# Altium project stepper_motor.PrjPcb
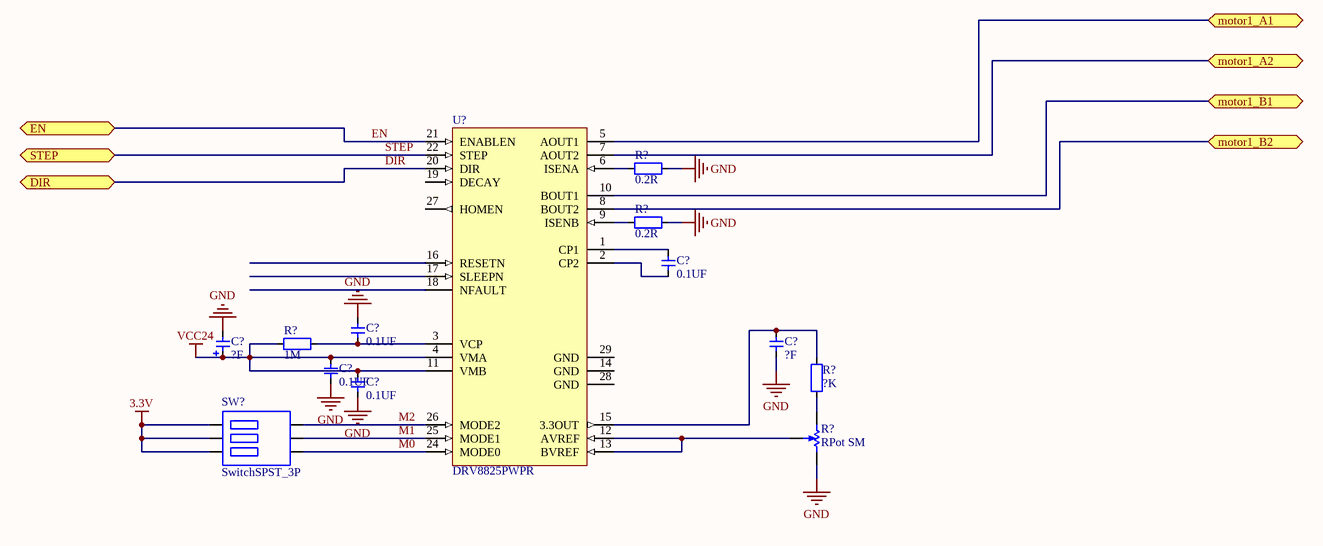
[diagram p0: drv8825.SchDoc]
6 sheets, 109 parts. Net scope: hierarchical (ports join the sheet entries above them; power ports are global).
Board file: stepper_motor.PcbDoc
Sheets:
  drv8825.SchDoc
  stepper_motor.SchDoc
    U_DRV8825_MODE1 = DRV8825_MODE.SchDoc
    U_stm32f1 = stm32f1.SchDoc
    U_power = power.SchDoc
    U_output = output.SchDoc
    U_DRV8825_MODE2 = DRV8825_MODE.SchDoc
    U_DRV8825_MODE3 = DRV8825_MODE.SchDoc
    U_DRV8825_MODE4 = DRV8825_MODE.SchDoc
    U_DRV8825_MODE5 = DRV8825_MODE.SchDoc
    U_DRV8825_MODE6 = DRV8825_MODE.SchDoc
    U_DRV8825_MODE7 = DRV8825_MODE.SchDoc

## Sheet drv8825.SchDoc
size A4

### Parts
(Parts that share a designator on the sheet are numbered #1, #2 ... from top to bottom, then left to right.)
C?#1  value 0.1UF  [CAP_0603]  (hidden comment: Cap_0603)
C?#2  value 0.1UF  [CAP_0603]  (hidden comment: Cap_0603)
C?#3  value ?F  [CAP_0603]  (hidden comment: Cap_0603)
C?#4  value ?F  [CAPAE6666X77M]  (hidden comment: Cap_63*77)
C?#5  value 0.1UF  [CAP_0603]  (hidden comment: Cap_0603)
C?#6  value 0.1UF  [CAP_0603]  (hidden comment: Cap_0603)
R?#1  value 0.2R  [RES_0603]  (hidden comment: Res_0603)
R?#2  value 0.2R  [RES_0603]  (hidden comment: Res_0603)
R?#3  value 1M  [RES_0603]  (hidden comment: Res_0603)
R?#4  value ?K  [RES_0603]  (hidden comment: Res_0603)
R?#5  RPot SM  [POT4MM-2]
SW?  SwitchSPST_3P  [SwitchSPDT_P2_180]
U?#1  DRV8825PWPR  [PWP0028D_L]

### Ports
DIR, EN, motor1_A1, motor1_A2, motor1_B1, motor1_B2, STEP

### Nets
3.3V: SW?.1ON(ON) SW?.2ON(NO) SW?.3ON(NO)  [project net 3.3]
GND: C?#2.2 C?#3.1 C?#4.2 C?#5.1 C?#6.1 R?#1.2 R?#2.2 R?#5.CW(+)
VCC24: C?#4.1 C?#5.2 C?#6.2 R?#3.1 U?#1.4(VMA) U?#1.11(VMB)
DIR: U?#1.20(DIR) ; port DIR
EN: U?#1.21(ENABLEN) ; port EN
M0: SW?.1(COMMON) U?#1.24(MODE0)
M1: SW?.2(COMMON) U?#1.25(MODE1)
M2: SW?.3(COMMON) U?#1.26(MODE2)
STEP: U?#1.22(STEP) ; port STEP
NetC?#1_1: C?#1.1 U?#1.2(CP2)
NetC?#1_2: C?#1.2 U?#1.1(CP1)
NetC?#2_1: C?#2.1 R?#3.2 U?#1.3(VCP)
NetC?#3_2: C?#3.2 R?#4.2 U?#1.15(3.3OUT)
NetR?#1_1: R?#1.1 U?#1.6(ISENA)
NetR?#2_1: R?#2.1 U?#1.9(ISENB)
NetR?#4_1: R?#4.1 R?#5.CCW(-)
NetR?#5_W: R?#5.W U?#1.12(AVREF) U?#1.13(BVREF)
NetU?#1_5: U?#1.5(AOUT1) ; port motor1_A1
NetU?#1_7: U?#1.7(AOUT2) ; port motor1_A2
NetU?#1_8: U?#1.8(BOUT2) ; port motor1_B2
NetU?#1_10: U?#1.10(BOUT1) ; port motor1_B1

Not connected (* = marked no-connect by the designer): U?#1 14(GND) 16(RESETN) 17(SLEEPN) 18(NFAULT) 19(DECAY) 27(HOMEN) 28(GND) 29(GND)

### Library data of the parts
C?#1-C?#3 C?#5 C?#6 = Cap_0603: Capacitor
C?#4 = Cap_Tan_0805: Capacitor
R?#1-R?#4 = Res_0603: Resistor
R?#5 = RPot SM: Square Trimming Potentiometer; Published: 17-Dec-2003; DatasheetVersion: Oct-2003; PackageReference: POT4MM-2; Publisher: Altium Limited; PackageDescription: Square Trimming Potentiometer; ComponentLink1Description: Manufacturer Link; ComponentLink1URL: http://bourns.com/2/search.html
SW? = SwitchSPST_3P: Switch
U?#1 = TI-DRV8818PWP28-6405X2000TP: 2.5 A Bipolar Stepper Motor Driver with On-Chip 1/8 MicroStepping Indexer (Step / Dir Ctrl), 8 to 35 V, -40 to 85 degC, 28-pin SOP (PWP28), Green (RoHS & no Sb/Br); PartNumber: DRV8818PWPR; Peak Output Current(A): 2.5; Vs(Max)(V): 35; RMS Output Current(A): 1.75; Vs(Min)(V): 8; rDS (ON) (LS + HS)(mOhms): 370; ComponentLink1URL: http://www.ti.com/; PackageDescription: 28-Pin Plastic Small Outline, Body 4.4 x 9.7 mm, Pitch 0.65 mm; Package Reference: PWP0028D; ComponentLink1Description: Manufacturer URL; ComponentLink2Description: Datasheet; Code_JEDEC: MO-153; ComponentLink2URL: http://www.ti.com/general/docs/lit/getliterature.tsp?genericPartNumber=DRV8818&fileType=pdf; DatasheetVersion: SLVSAX9B; ComponentLink3Description: Package Specification; Mounting Technology: Surface Mount; Eco-Plan: Green (RoHS & no Sb/Br); ComponentLink3URL: http://www.ti.com/litv/pdf/mpds373; PackageVersion: 4073225-6/I, 05/2011; Control I/F: INDEXER

## Sheet stepper_motor.SchDoc
size A3
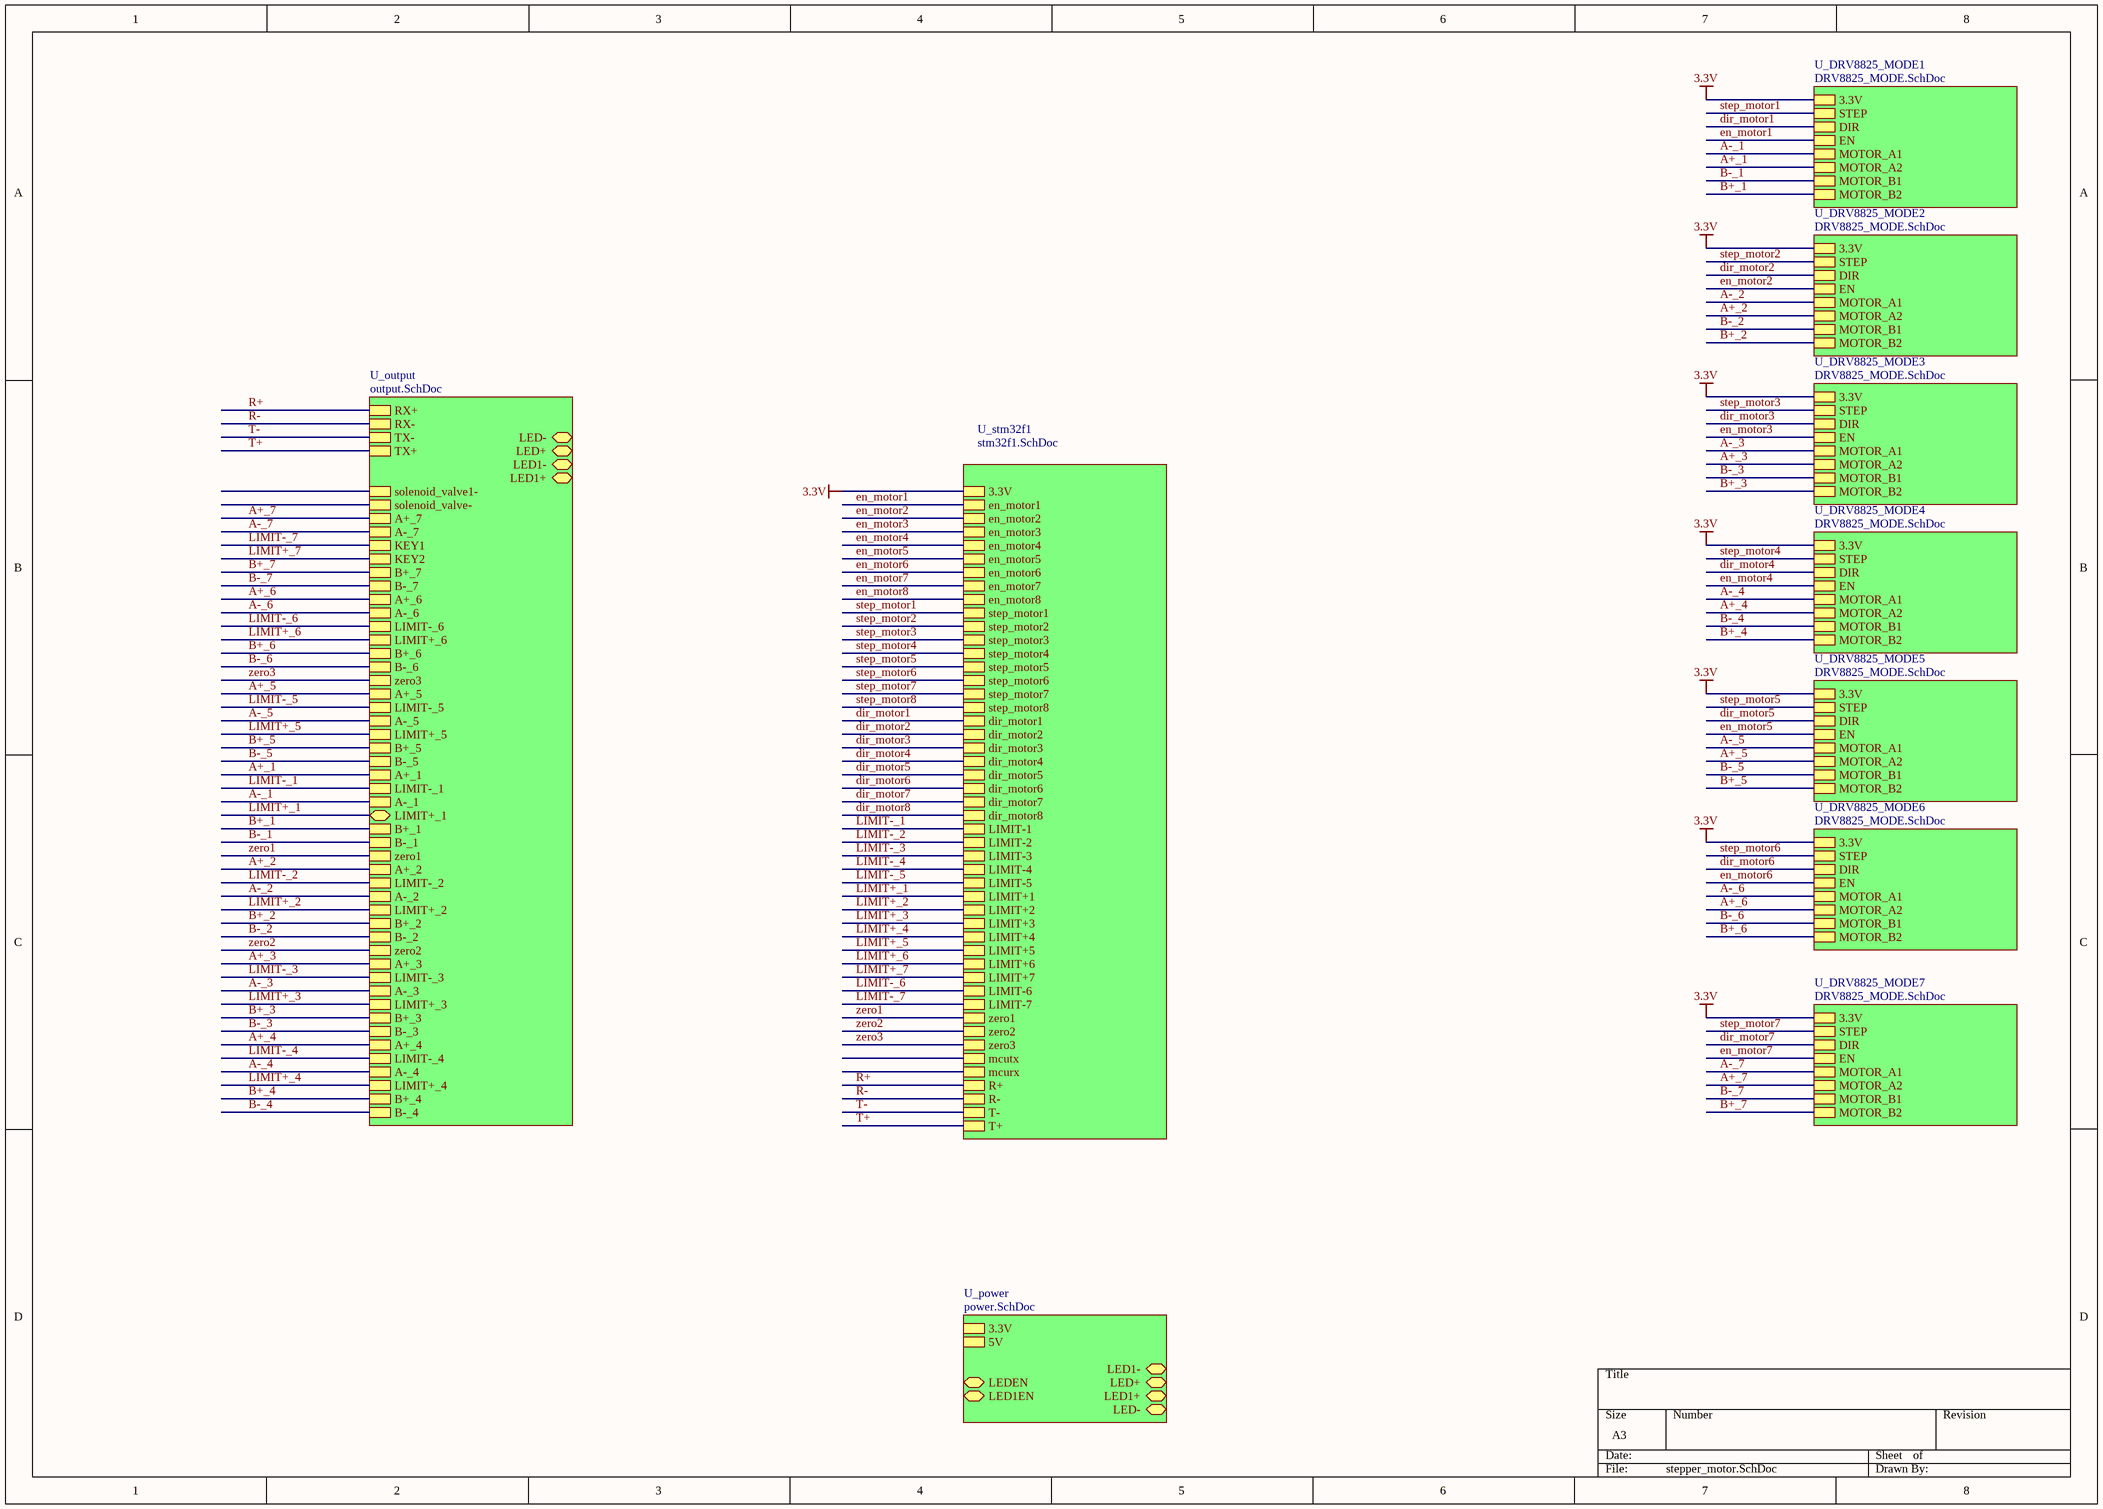
[diagram p1: stepper_motor.SchDoc]

### Sub-sheets
U_DRV8825_MODE1 = DRV8825_MODE.SchDoc: 3.3V, STEP, DIR, EN, MOTOR_A1, MOTOR_A2, MOTOR_B1, MOTOR_B2
U_DRV8825_MODE2 = DRV8825_MODE.SchDoc: 3.3V, STEP, DIR, EN, MOTOR_A1, MOTOR_A2, MOTOR_B1, MOTOR_B2
U_DRV8825_MODE3 = DRV8825_MODE.SchDoc: 3.3V, STEP, DIR, EN, MOTOR_A1, MOTOR_A2, MOTOR_B1, MOTOR_B2
U_DRV8825_MODE4 = DRV8825_MODE.SchDoc: 3.3V, STEP, DIR, EN, MOTOR_A1, MOTOR_A2, MOTOR_B1, MOTOR_B2
U_DRV8825_MODE5 = DRV8825_MODE.SchDoc: 3.3V, STEP, DIR, EN, MOTOR_A1, MOTOR_A2, MOTOR_B1, MOTOR_B2
U_DRV8825_MODE6 = DRV8825_MODE.SchDoc: 3.3V, STEP, DIR, EN, MOTOR_A1, MOTOR_A2, MOTOR_B1, MOTOR_B2
U_DRV8825_MODE7 = DRV8825_MODE.SchDoc: 3.3V, STEP, DIR, EN, MOTOR_A1, MOTOR_A2, MOTOR_B1, MOTOR_B2
U_output = output.SchDoc: RX+, RX-, TX-, TX+, solenoid_valve1-, solenoid_valve-, A+_7, A-_7, KEY1, KEY2, B+_7, B-_7, A+_6, A-_6, LIMIT-_6, LIMIT+_6, B+_6, B-_6, zero3, A+_5, LIMIT-_5, A-_5, LIMIT+_5, B+_5, B-_5, A+_1, LIMIT-_1, A-_1, B+_1, B-_1, zero1, A+_2, LIMIT-_2, A-_2, LIMIT+_2, B+_2, B-_2, zero2, A+_3, LIMIT-_3, A-_3, LIMIT+_3, B+_3, B-_3, A+_4, LIMIT-_4, A-_4, LIMIT+_4, B+_4, B-_4, LIMIT+_1, LED1+, LED+, LED-, LED1-
U_power = power.SchDoc: 3.3V, 5V, LED1-, LED+, LED1+, LED-, LEDEN, LED1EN
U_stm32f1 = stm32f1.SchDoc: 3.3V, en_motor1, en_motor2, en_motor3, en_motor4, en_motor5, en_motor6, en_motor7, en_motor8, step_motor1, step_motor2, step_motor3, step_motor4, step_motor5, step_motor6, step_motor7, step_motor8, dir_motor1, dir_motor2, dir_motor3, dir_motor4, dir_motor5, dir_motor6, dir_motor7, dir_motor8, LIMIT-1, LIMIT-2, LIMIT-3, LIMIT-4, LIMIT-5, LIMIT+1, LIMIT+2, LIMIT+3, LIMIT+4, LIMIT+5, LIMIT+6, LIMIT+7, LIMIT-6, LIMIT-7, zero1, zero2, zero3, mcutx, mcurx, R+, R-, T-, T+

### Nets
3.3V: sheet U_DRV8825_MODE1/3.3V, sheet U_stm32f1/3.3V, sheet U_power/3.3V, sheet U_DRV8825_MODE2/3.3V, sheet U_DRV8825_MODE3/3.3V, sheet U_DRV8825_MODE4/3.3V, sheet U_DRV8825_MODE5/3.3V, sheet U_DRV8825_MODE6/3.3V, sheet U_DRV8825_MODE7/3.3V  [project net 3.3]
A+_1: sheet U_DRV8825_MODE1/MOTOR_A2, sheet U_output/A+_1
A+_2: sheet U_output/A+_2, sheet U_DRV8825_MODE2/MOTOR_A2
A+_3: sheet U_output/A+_3, sheet U_DRV8825_MODE3/MOTOR_A2
A+_4: sheet U_output/A+_4, sheet U_DRV8825_MODE4/MOTOR_A2
A+_5: sheet U_output/A+_5, sheet U_DRV8825_MODE5/MOTOR_A2
A+_6: sheet U_output/A+_6, sheet U_DRV8825_MODE6/MOTOR_A2
A+_7: sheet U_output/A+_7, sheet U_DRV8825_MODE7/MOTOR_A2
A-_1: sheet U_DRV8825_MODE1/MOTOR_A1, sheet U_output/A-_1
A-_2: sheet U_output/A-_2, sheet U_DRV8825_MODE2/MOTOR_A1
A-_3: sheet U_output/A-_3, sheet U_DRV8825_MODE3/MOTOR_A1
A-_4: sheet U_output/A-_4, sheet U_DRV8825_MODE4/MOTOR_A1
A-_5: sheet U_output/A-_5, sheet U_DRV8825_MODE5/MOTOR_A1
A-_6: sheet U_output/A-_6, sheet U_DRV8825_MODE6/MOTOR_A1
A-_7: sheet U_output/A-_7, sheet U_DRV8825_MODE7/MOTOR_A1
B+_1: sheet U_DRV8825_MODE1/MOTOR_B2, sheet U_output/B+_1
B+_2: sheet U_output/B+_2, sheet U_DRV8825_MODE2/MOTOR_B2
B+_3: sheet U_output/B+_3, sheet U_DRV8825_MODE3/MOTOR_B2
B+_4: sheet U_output/B+_4, sheet U_DRV8825_MODE4/MOTOR_B2
B+_5: sheet U_output/B+_5, sheet U_DRV8825_MODE5/MOTOR_B2
B+_6: sheet U_output/B+_6, sheet U_DRV8825_MODE6/MOTOR_B2
B+_7: sheet U_output/B+_7, sheet U_DRV8825_MODE7/MOTOR_B2
B-_1: sheet U_DRV8825_MODE1/MOTOR_B1, sheet U_output/B-_1
B-_2: sheet U_output/B-_2, sheet U_DRV8825_MODE2/MOTOR_B1
B-_3: sheet U_output/B-_3, sheet U_DRV8825_MODE3/MOTOR_B1
B-_4: sheet U_output/B-_4, sheet U_DRV8825_MODE4/MOTOR_B1
B-_5: sheet U_output/B-_5, sheet U_DRV8825_MODE5/MOTOR_B1
B-_6: sheet U_output/B-_6, sheet U_DRV8825_MODE6/MOTOR_B1
B-_7: sheet U_output/B-_7, sheet U_DRV8825_MODE7/MOTOR_B1
dir_motor1: sheet U_DRV8825_MODE1/DIR, sheet U_stm32f1/dir_motor1
dir_motor2: sheet U_stm32f1/dir_motor2, sheet U_DRV8825_MODE2/DIR
dir_motor3: sheet U_stm32f1/dir_motor3, sheet U_DRV8825_MODE3/DIR
dir_motor4: sheet U_stm32f1/dir_motor4, sheet U_DRV8825_MODE4/DIR
dir_motor5: sheet U_stm32f1/dir_motor5, sheet U_DRV8825_MODE5/DIR
dir_motor6: sheet U_stm32f1/dir_motor6, sheet U_DRV8825_MODE6/DIR
dir_motor7: sheet U_stm32f1/dir_motor7, sheet U_DRV8825_MODE7/DIR
en_motor1: sheet U_DRV8825_MODE1/EN, sheet U_stm32f1/en_motor1
en_motor2: sheet U_stm32f1/en_motor2, sheet U_DRV8825_MODE2/EN
en_motor3: sheet U_stm32f1/en_motor3, sheet U_DRV8825_MODE3/EN
en_motor4: sheet U_stm32f1/en_motor4, sheet U_DRV8825_MODE4/EN
en_motor5: sheet U_stm32f1/en_motor5, sheet U_DRV8825_MODE5/EN
en_motor6: sheet U_stm32f1/en_motor6, sheet U_DRV8825_MODE6/EN
en_motor7: sheet U_stm32f1/en_motor7, sheet U_DRV8825_MODE7/EN
LIMIT+_1: sheet U_stm32f1/LIMIT+1, sheet U_output/LIMIT+_1  [project net LIMIT+1]
LIMIT+_2: sheet U_stm32f1/LIMIT+2, sheet U_output/LIMIT+_2  [project net LIMIT+2]
LIMIT+_3: sheet U_stm32f1/LIMIT+3, sheet U_output/LIMIT+_3  [project net LIMIT+3]
LIMIT+_4: sheet U_stm32f1/LIMIT+4, sheet U_output/LIMIT+_4  [project net LIMIT+4]
LIMIT+_5: sheet U_stm32f1/LIMIT+5, sheet U_output/LIMIT+_5  [project net LIMIT+5]
LIMIT+_6: sheet U_stm32f1/LIMIT+6, sheet U_output/LIMIT+_6  [project net LIMIT+6]
LIMIT+_7: sheet U_stm32f1/LIMIT+7, sheet U_output/KEY2  [project net LIMIT+7]
LIMIT-_1: sheet U_stm32f1/LIMIT-1, sheet U_output/LIMIT-_1  [project net LIMIT-1]
LIMIT-_2: sheet U_stm32f1/LIMIT-2, sheet U_output/LIMIT-_2  [project net LIMIT-2]
LIMIT-_3: sheet U_stm32f1/LIMIT-3, sheet U_output/LIMIT-_3  [project net LIMIT-3]
LIMIT-_4: sheet U_stm32f1/LIMIT-4, sheet U_output/LIMIT-_4  [project net LIMIT-4]
LIMIT-_5: sheet U_stm32f1/LIMIT-5, sheet U_output/LIMIT-_5  [project net LIMIT-5]
LIMIT-_6: sheet U_stm32f1/LIMIT-6, sheet U_output/LIMIT-_6  [project net LIMIT-6]
LIMIT-_7: sheet U_stm32f1/LIMIT-7, sheet U_output/KEY1  [project net LIMIT-7]
R+: sheet U_stm32f1/R+, sheet U_output/RX+
R-: sheet U_stm32f1/R-, sheet U_output/RX-
step_motor1: sheet U_DRV8825_MODE1/STEP, sheet U_stm32f1/step_motor1
step_motor2: sheet U_stm32f1/step_motor2, sheet U_DRV8825_MODE2/STEP
step_motor3: sheet U_stm32f1/step_motor3, sheet U_DRV8825_MODE3/STEP
step_motor4: sheet U_stm32f1/step_motor4, sheet U_DRV8825_MODE4/STEP
step_motor5: sheet U_stm32f1/step_motor5, sheet U_DRV8825_MODE5/STEP
step_motor6: sheet U_stm32f1/step_motor6, sheet U_DRV8825_MODE6/STEP
step_motor7: sheet U_stm32f1/step_motor7, sheet U_DRV8825_MODE7/STEP
T+: sheet U_stm32f1/T+, sheet U_output/TX+
T-: sheet U_stm32f1/T-, sheet U_output/TX-
zero1: sheet U_stm32f1/zero1, sheet U_output/zero1
zero2: sheet U_stm32f1/zero2, sheet U_output/zero2
zero3: sheet U_stm32f1/zero3, sheet U_output/zero3

## Sheet DRV8825_MODE.SchDoc
size A4
Used 7 times, as channels U_DRV8825_MODE1, U_DRV8825_MODE2, U_DRV8825_MODE3, U_DRV8825_MODE4, U_DRV8825_MODE5, U_DRV8825_MODE6, U_DRV8825_MODE7. Parts and nets are listed once, with the designators drawn on the sheet.
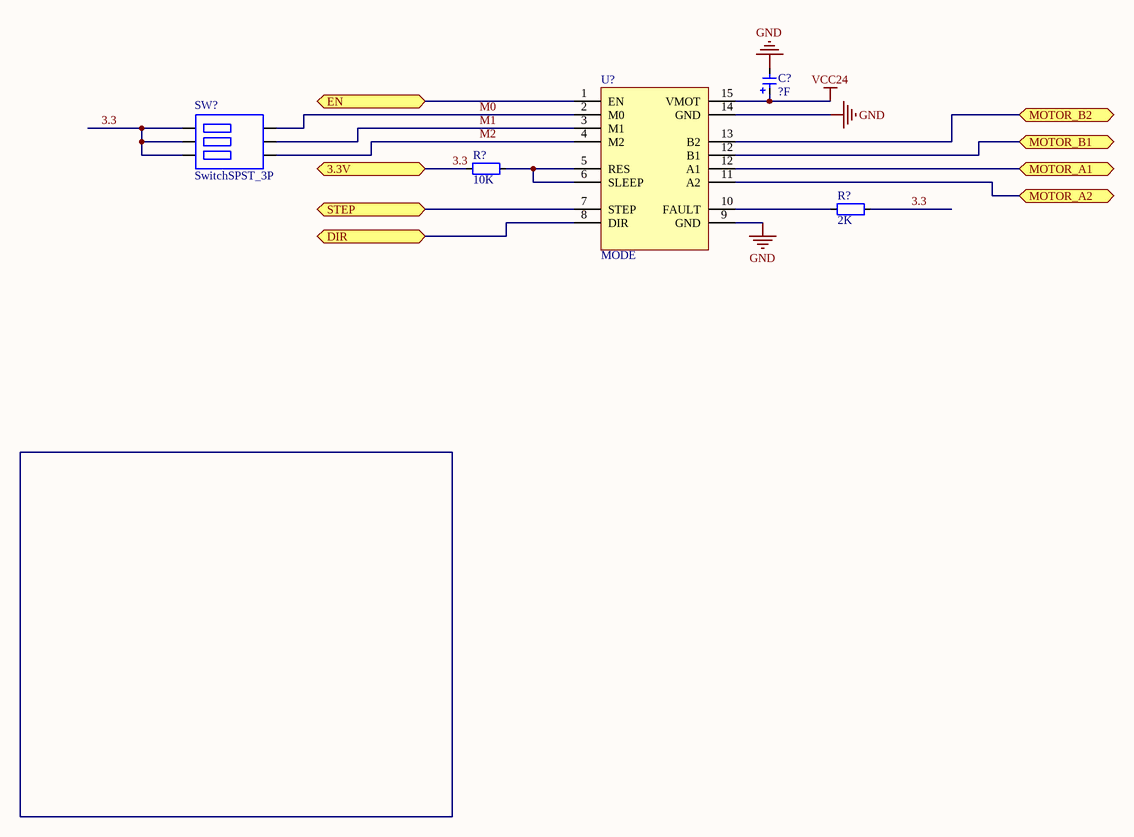
[diagram p2: DRV8825_MODE.SchDoc]

### Parts
(Parts that share a designator on the sheet are numbered #1, #2 ... from top to bottom, then left to right.)
C?  value ?F  [CAPAE6666X77M]  (hidden comment: Cap_63*77)
R?#1  value 10K  [RES_0603]  (hidden comment: Res_0603)
R?#2  value 2K  [RES_0603]  (hidden comment: Res_0603)
SW?  SwitchSPST_3P  [SwitchSPDT_P2_180]
U?  MODE  [drv8825mode]

### Ports
3.3V, DIR, EN, MOTOR_A1, MOTOR_A2, MOTOR_B1, MOTOR_B2, STEP

### Nets
GND: C?.2 U?.9(GND) U?.14(GND)
VCC24: C?.1 U?.15(VMOT)
3.3: R?#1.1 R?#2.2 SW?.1ON(ON) SW?.2ON(NO) SW?.3ON(NO) ; port 3.3V
DIR: U?.8(DIR) ; port DIR
EN: U?.1(EN) ; port EN
M0: SW?.3(COMMON) U?.2(M0)
M1: SW?.2(COMMON) U?.3(M1)
M2: SW?.1(COMMON) U?.4(M2)
MOTOR_A1: U?.12(A1) ; port MOTOR_A1
MOTOR_A2: U?.11(A2) ; port MOTOR_A2
MOTOR_B1: U?.12(B1) ; port MOTOR_B1
MOTOR_B2: U?.13(B2) ; port MOTOR_B2
STEP: U?.7(STEP) ; port STEP
NetR?#1_2: R?#1.2 U?.5(RES) U?.6(SLEEP)
NetR?#2_1: R?#2.1 U?.10(FAULT)

### Channels
U_DRV8825_MODE1: designators C?=C?_U_DRV8825_MODE1 R?=R?_U_DRV8825_MODE1#2 R?=R?_U_DRV8825_MODE1#1 SW?=SW?_U_DRV8825_MODE1 U?=U?_U_DRV8825_MODE1; ports 3.3V=3.3 DIR=dir_motor1 EN=en_motor1 MOTOR_A1=A-_1 MOTOR_A2=A+_1 MOTOR_B1=B-_1 MOTOR_B2=B+_1 STEP=step_motor1
U_DRV8825_MODE2: designators C?=C?_U_DRV8825_MODE2 R?=R?_U_DRV8825_MODE2#2 R?=R?_U_DRV8825_MODE2#1 SW?=SW?_U_DRV8825_MODE2 U?=U?_U_DRV8825_MODE2; ports 3.3V=3.3 DIR=dir_motor2 EN=en_motor2 MOTOR_A1=A-_2 MOTOR_A2=A+_2 MOTOR_B1=B-_2 MOTOR_B2=B+_2 STEP=step_motor2
U_DRV8825_MODE3: designators C?=C?_U_DRV8825_MODE3 R?=R?_U_DRV8825_MODE3#2 R?=R?_U_DRV8825_MODE3#1 SW?=SW?_U_DRV8825_MODE3 U?=U?_U_DRV8825_MODE3; ports 3.3V=3.3 DIR=dir_motor3 EN=en_motor3 MOTOR_A1=A-_3 MOTOR_A2=A+_3 MOTOR_B1=B-_3 MOTOR_B2=B+_3 STEP=step_motor3
U_DRV8825_MODE4: designators C?=C?_U_DRV8825_MODE4 R?=R?_U_DRV8825_MODE4#2 R?=R?_U_DRV8825_MODE4#1 SW?=SW?_U_DRV8825_MODE4 U?=U?_U_DRV8825_MODE4; ports 3.3V=3.3 DIR=dir_motor4 EN=en_motor4 MOTOR_A1=A-_4 MOTOR_A2=A+_4 MOTOR_B1=B-_4 MOTOR_B2=B+_4 STEP=step_motor4
U_DRV8825_MODE5: designators C?=C?_U_DRV8825_MODE5 R?=R?_U_DRV8825_MODE5#2 R?=R?_U_DRV8825_MODE5#1 SW?=SW?_U_DRV8825_MODE5 U?=U?_U_DRV8825_MODE5; ports 3.3V=3.3 DIR=dir_motor5 EN=en_motor5 MOTOR_A1=A-_5 MOTOR_A2=A+_5 MOTOR_B1=B-_5 MOTOR_B2=B+_5 STEP=step_motor5
U_DRV8825_MODE6: designators C?=C?_U_DRV8825_MODE6 R?=R?_U_DRV8825_MODE6#2 R?=R?_U_DRV8825_MODE6#1 SW?=SW?_U_DRV8825_MODE6 U?=U?_U_DRV8825_MODE6; ports 3.3V=3.3 DIR=dir_motor6 EN=en_motor6 MOTOR_A1=A-_6 MOTOR_A2=A+_6 MOTOR_B1=B-_6 MOTOR_B2=B+_6 STEP=step_motor6
U_DRV8825_MODE7: designators C?=C?_U_DRV8825_MODE7 R?=R?_U_DRV8825_MODE7#2 R?=R?_U_DRV8825_MODE7#1 SW?=SW?_U_DRV8825_MODE7 U?=U?_U_DRV8825_MODE7; ports 3.3V=3.3 DIR=dir_motor7 EN=en_motor7 MOTOR_A1=A-_7 MOTOR_A2=A+_7 MOTOR_B1=B-_7 MOTOR_B2=B+_7 STEP=step_motor7

### Library data of the parts
C? = Cap_Tan_0805: Capacitor
R?#1 R?#2 = Res_0603: Resistor
SW? = SwitchSPST_3P: Switch
U? = DRV8825_MODE

## Sheet stm32f1.SchDoc
size A3
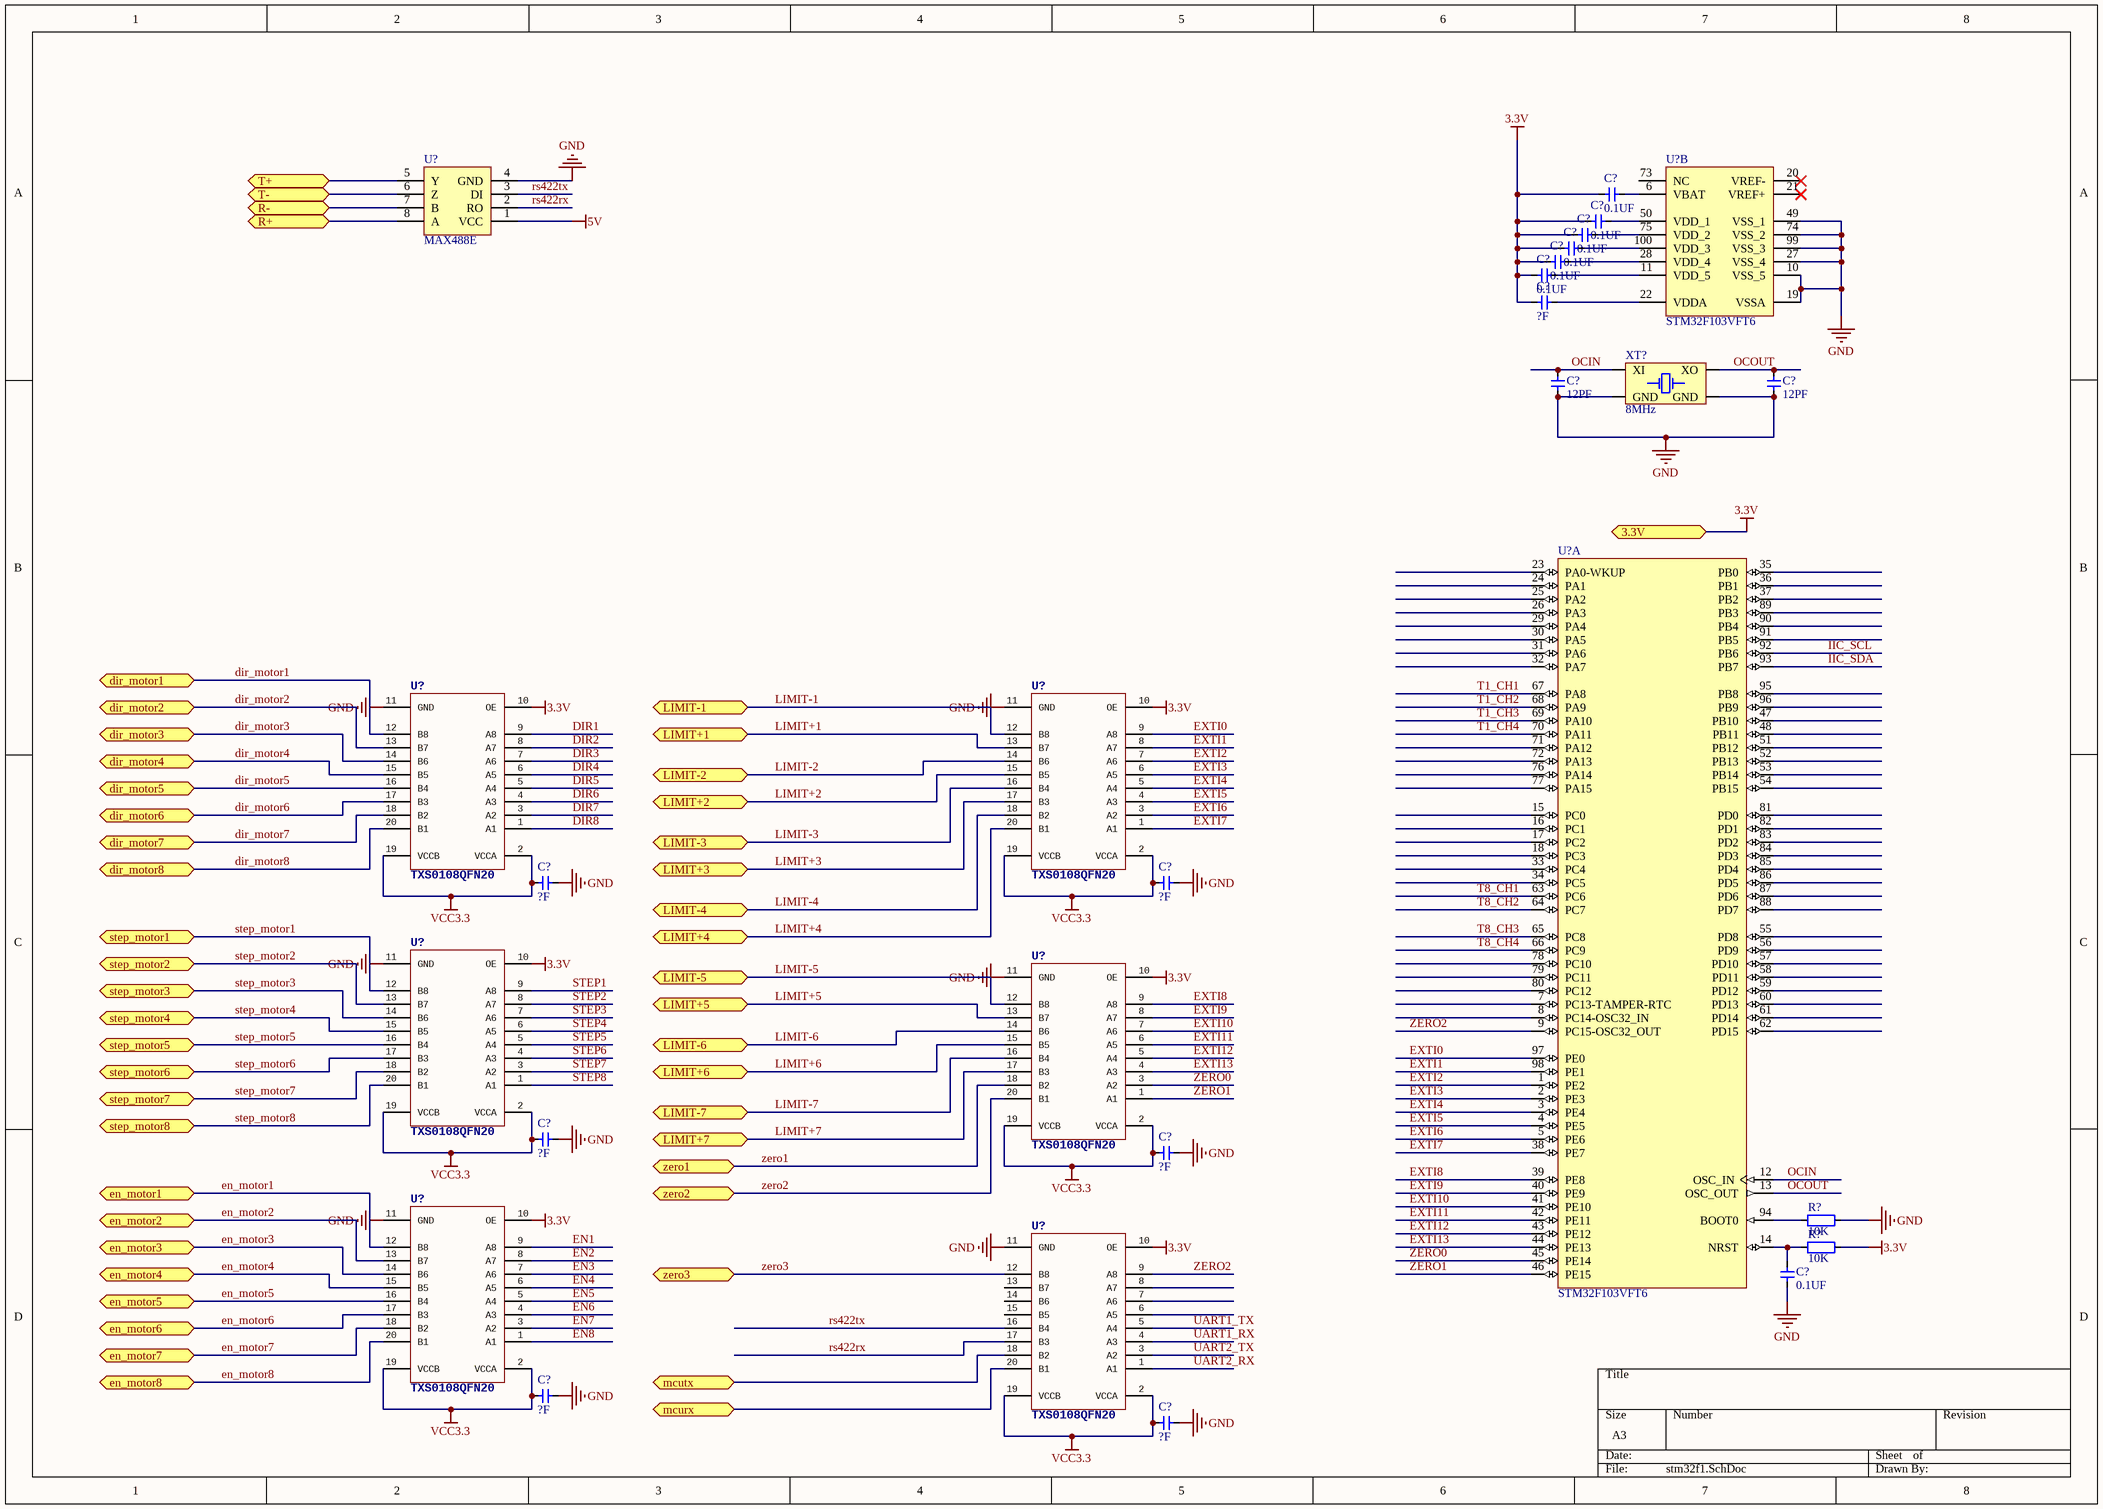
[diagram p3: stm32f1.SchDoc]

### Parts
(Parts that share a designator on the sheet are numbered #1, #2 ... from top to bottom, then left to right.)
C?#7  value 0.1UF  [CAP_0603]  (hidden comment: Cap_0603)
C?#8  value 0.1UF  [CAP_0603]  (hidden comment: Cap_0603)
C?#9  value 0.1UF  [CAP_0603]  (hidden comment: Cap_0603)
C?#10  value 0.1UF  [CAP_0603]  (hidden comment: Cap_0603)
C?#11  value 0.1UF  [CAP_0603]  (hidden comment: Cap_0603)
C?#12  value 0.1UF  [CAP_0603]  (hidden comment: Cap_0603)
C?#13  value ?F  [CAP_0603]  (hidden comment: Cap_0603)
C?#14  value 12PF  [CAP_0603]  (hidden comment: Cap_0603)
C?#15  value 12PF  [CAP_0603]  (hidden comment: Cap_0603)
C?#16  value ?F  [CAP_0603]  (hidden comment: Cap_0603)
C?#17  value ?F  [CAP_0603]  (hidden comment: Cap_0603)
C?#18  value ?F  [CAP_0603]  (hidden comment: Cap_0603)
C?#19  value ?F  [CAP_0603]  (hidden comment: Cap_0603)
C?#20  value 0.1UF  [CAP_0603]  (hidden comment: Cap_0603)
C?#21  value ?F  [CAP_0603]  (hidden comment: Cap_0603)
C?#22  value ?F  [CAP_0603]  (hidden comment: Cap_0603)
R?#6  value 10K  [RES_0603]  (hidden comment: Res_0603)
R?#7  value 10K  [RES_0603]  (hidden comment: Res_0603)
U?#2  STM32F103VFT6  [LQFP100_N]  (part B of 2)
U?#3  MAX488E  [SOP_E150_8]
U?#4  STM32F103VFT6  [LQFP100_N]  (part A of 2)
U?#5  TXS0108QFN20  [QFN20-RGY]
U?#6  TXS0108QFN20  [QFN20-RGY]
U?#7  TXS0108QFN20  [QFN20-RGY]
U?#8  TXS0108QFN20  [QFN20-RGY]
U?#9  TXS0108QFN20  [QFN20-RGY]
U?#10  TXS0108QFN20  [QFN20-RGY]
XT?  value 8MHz  [XT_3225_4]  (hidden comment: XTAL_3225_4P)

### Ports
3.3V, dir_motor1, dir_motor2, dir_motor3, dir_motor4, dir_motor5, dir_motor6, dir_motor7, dir_motor8, en_motor1, en_motor2, en_motor3, en_motor4, en_motor5, en_motor6, en_motor7, en_motor8, LIMIT+1, LIMIT+2, LIMIT+3, LIMIT+4, LIMIT+5, LIMIT+6, LIMIT+7, LIMIT-1, LIMIT-2, LIMIT-3, LIMIT-4, LIMIT-5, LIMIT-6, LIMIT-7, mcurx, mcutx, R+, R-, step_motor1, step_motor2, step_motor3, step_motor4, step_motor5, step_motor6, step_motor7, step_motor8, T+, T-, zero1, zero2, zero3

### Nets
3.3V: C?#7.1 C?#8.1 C?#9.1 C?#10.1 C?#11.1 C?#12.1 C?#13.1 R?#7.2 U?#5.10(OE) U?#6.10(OE) U?#7.10(OE) U?#8.10(OE) U?#9.10(OE) U?#10.10(OE) ; port 3.3V  [project net 3.3]
5V: U?#3.1(VCC)
GND: C?#14.1 C?#15.1 C?#16.1 C?#17.1 C?#18.1 C?#19.1 C?#20.1 C?#21.1 C?#22.1 R?#6.2 U?#2.10(VSS_5) U?#2.19(VSSA) U?#2.27(VSS_4) U?#2.49(VSS_1) U?#2.74(VSS_2) U?#2.99(VSS_3) U?#3.4(GND) U?#5.11(GND) U?#6.11(GND) U?#7.11(GND) U?#8.11(GND) U?#9.11(GND) U?#10.11(GND) XT?.2(GND) XT?.4(GND)
VCC3.3: C?#16.2 C?#17.2 C?#18.2 C?#19.2 C?#21.2 C?#22.2 U?#5.2(VCCA) U?#5.19(VCCB) U?#6.2(VCCA) U?#6.19(VCCB) U?#7.2(VCCA) U?#7.19(VCCB) U?#8.2(VCCA) U?#8.19(VCCB) U?#9.2(VCCA) U?#9.19(VCCB) U?#10.2(VCCA) U?#10.19(VCCB)
DIR1: U?#5.9(A8)
DIR2: U?#5.8(A7)
DIR3: U?#5.7(A6)
DIR4: U?#5.6(A5)
DIR5: U?#5.5(A4)
DIR6: U?#5.4(A3)
DIR7: U?#5.3(A2)
DIR8: U?#5.1(A1)
dir_motor1: U?#5.12(B8) ; port dir_motor1
dir_motor2: U?#5.13(B7) ; port dir_motor2
dir_motor3: U?#5.14(B6) ; port dir_motor3
dir_motor4: U?#5.15(B5) ; port dir_motor4
dir_motor5: U?#5.16(B4) ; port dir_motor5
dir_motor6: U?#5.17(B3) ; port dir_motor6
dir_motor7: U?#5.18(B2) ; port dir_motor7
dir_motor8: U?#5.20(B1) ; port dir_motor8
EN1: U?#9.9(A8)
EN2: U?#9.8(A7)
EN3: U?#9.7(A6)
EN4: U?#9.6(A5)
EN5: U?#9.5(A4)
EN6: U?#9.4(A3)
EN7: U?#9.3(A2)
EN8: U?#9.1(A1)
en_motor1: U?#9.12(B8) ; port en_motor1
en_motor2: U?#9.13(B7) ; port en_motor2
en_motor3: U?#9.14(B6) ; port en_motor3
en_motor4: U?#9.15(B5) ; port en_motor4
en_motor5: U?#9.16(B4) ; port en_motor5
en_motor6: U?#9.17(B3) ; port en_motor6
en_motor7: U?#9.18(B2) ; port en_motor7
en_motor8: U?#9.20(B1) ; port en_motor8
EXTI0: U?#4.97(PE0) U?#6.9(A8)
EXTI1: U?#4.98(PE1) U?#6.8(A7)
EXTI2: U?#4.1(PE2) U?#6.7(A6)
EXTI3: U?#4.2(PE3) U?#6.6(A5)
EXTI4: U?#4.3(PE4) U?#6.5(A4)
EXTI5: U?#4.4(PE5) U?#6.4(A3)
EXTI6: U?#4.5(PE6) U?#6.3(A2)
EXTI7: U?#4.38(PE7) U?#6.1(A1)
EXTI8: U?#4.39(PE8) U?#8.9(A8)
EXTI9: U?#4.40(PE9) U?#8.8(A7)
EXTI10: U?#4.41(PE10) U?#8.7(A6)
EXTI11: U?#4.42(PE11) U?#8.6(A5)
EXTI12: U?#4.43(PE12) U?#8.5(A4)
EXTI13: U?#4.44(PE13) U?#8.4(A3)
IIC_SCL: U?#4.92(PB6)
IIC_SDA: U?#4.93(PB7)
LIMIT+1: U?#6.13(B7) ; port LIMIT+1
LIMIT+2: U?#6.15(B5) ; port LIMIT+2
LIMIT+3: U?#6.17(B3) ; port LIMIT+3
LIMIT+4: U?#6.20(B1) ; port LIMIT+4
LIMIT+5: U?#8.13(B7) ; port LIMIT+5
LIMIT+6: U?#8.15(B5) ; port LIMIT+6
LIMIT+7: U?#8.17(B3) ; port LIMIT+7
LIMIT-1: U?#6.12(B8) ; port LIMIT-1
LIMIT-2: U?#6.14(B6) ; port LIMIT-2
LIMIT-3: U?#6.16(B4) ; port LIMIT-3
LIMIT-4: U?#6.18(B2) ; port LIMIT-4
LIMIT-5: U?#8.12(B8) ; port LIMIT-5
LIMIT-6: U?#8.14(B6) ; port LIMIT-6
LIMIT-7: U?#8.16(B4) ; port LIMIT-7
OCIN: C?#14.2 U?#4.12(OSC_IN) XT?.1(XI)
OCOUT: C?#15.2 U?#4.13(OSC_OUT) XT?.3(XO)
R+: U?#3.8(A) ; port R+
R-: U?#3.7(B) ; port R-
rs422rx: U?#3.2(RO) U?#10.17(B3)
rs422tx: U?#3.3(DI) U?#10.16(B4)
STEP1: U?#7.9(A8)
STEP2: U?#7.8(A7)
STEP3: U?#7.7(A6)
STEP4: U?#7.6(A5)
STEP5: U?#7.5(A4)
STEP6: U?#7.4(A3)
STEP7: U?#7.3(A2)
STEP8: U?#7.1(A1)
step_motor1: U?#7.12(B8) ; port step_motor1
step_motor2: U?#7.13(B7) ; port step_motor2
step_motor3: U?#7.14(B6) ; port step_motor3
step_motor4: U?#7.15(B5) ; port step_motor4
step_motor5: U?#7.16(B4) ; port step_motor5
step_motor6: U?#7.17(B3) ; port step_motor6
step_motor7: U?#7.18(B2) ; port step_motor7
step_motor8: U?#7.20(B1) ; port step_motor8
T1_CH1: U?#4.67(PA8)
T1_CH2: U?#4.68(PA9)
T1_CH3: U?#4.69(PA10)
T1_CH4: U?#4.70(PA11)
T8_CH1: U?#4.63(PC6)
T8_CH2: U?#4.64(PC7)
T8_CH3: U?#4.65(PC8)
T8_CH4: U?#4.66(PC9)
T+: U?#3.5(Y) ; port T+
T-: U?#3.6(Z) ; port T-
UART1_RX: U?#10.4(A3)
UART1_TX: U?#10.5(A4)
UART2_RX: U?#10.1(A1)
UART2_TX: U?#10.3(A2)
ZERO0: U?#4.45(PE14) U?#8.3(A2)
zero1: U?#4.46(PE15) U?#8.1(A1) U?#8.18(B2) ; port zero1
zero2: U?#4.9(PC15-OSC32_OUT) U?#8.20(B1) U?#10.9(A8) ; port zero2
zero3: U?#10.12(B8) ; port zero3
NetC?#7_2: C?#7.2 U?#2.6(VBAT)
NetC?#8_2: C?#8.2 U?#2.50(VDD_1)
NetC?#9_2: C?#9.2 U?#2.75(VDD_2)
NetC?#10_2: C?#10.2 U?#2.100(VDD_3)
NetC?#11_2: C?#11.2 U?#2.28(VDD_4)
NetC?#12_2: C?#12.2 U?#2.11(VDD_5)
NetC?#13_2: C?#13.2 U?#2.22(VDDA)
NetC?#20_2: C?#20.2 R?#7.1 U?#4.14(NRST)
NetR?#6_1: R?#6.1 U?#4.94(BOOT0)
NetU?#10_18: U?#10.18(B2) ; port mcutx
NetU?#10_20: U?#10.20(B1) ; port mcurx

Not connected (* = marked no-connect by the designer): U?#2 20(VREF-)* 21(VREF+)* 73(NC); U?#4 7(PC13-TAMPER-RTC) 8(PC14-OSC32_IN) 15(PC0) 16(PC1) 17(PC2) 18(PC3) 23(PA0-WKUP) 24(PA1) 25(PA2) 26(PA3) 29(PA4) 30(PA5) 31(PA6) 32(PA7) 33(PC4) 34(PC5) 35(PB0) 36(PB1) 37(PB2) 47(PB10) 48(PB11) 51(PB12) 52(PB13) 53(PB14) 54(PB15) 55(PD8) 56(PD9) 57(PD10) 58(PD11) 59(PD12) 60(PD13) 61(PD14) 62(PD15) 71(PA12) 72(PA13) 76(PA14) 77(PA15) 78(PC10) 79(PC11) 80(PC12) 81(PD0) 82(PD1) 83(PD2) 84(PD3) 85(PD4) 86(PD5) 87(PD6) 88(PD7) 89(PB3) 90(PB4) 91(PB5) 95(PB8) 96(PB9); U?#10 6(A5) 7(A6) 8(A7) 13(B7) 14(B6) 15(B5)

### Library data of the parts
C?#7-C?#22 = Cap_0603: Capacitor
R?#6 R?#7 = Res_0603: Resistor
U?#2 U?#4 = STM32F103VFT6: STM32 ARM-based 32-bit MCU Performance Line with 768 kB Flash, 96 kB Internal RAM, -40 to +85癈 Temperature, 100-Pin LQFP, Tray; DatasheetVersion: rev2.0, Nov-2010; PackageVersion: rev13, Apr-2011; PackageReference: LQFP100; PackageDescription: 100-Pin Low-Profile Quad Flat Pack, 14 x 14 mm Body, 0.5 mm Pitch (LQFP100); ComponentLink1Description: Manufacturer URL; ComponentLink1URL: http://www.st.com/; ComponentLink2Description: STM32F103 Datasheet; ComponentLink2URL: http://www.st.com/internet/com/TECHNICAL_RESOURCES/TECHNICAL_LITERATURE/DATASHEET/CD00253742.pdf; ComponentLink3Description: STM32 Family Web Page; ComponentLink3URL: www.st.com/stm32
U?#5-U?#10 = TXS0108QFN20: PARTNO: TXS0108ERGYR
XT? = XTAL_3225_4P: Crystal Oscillator

## Sheet power.SchDoc
size A4
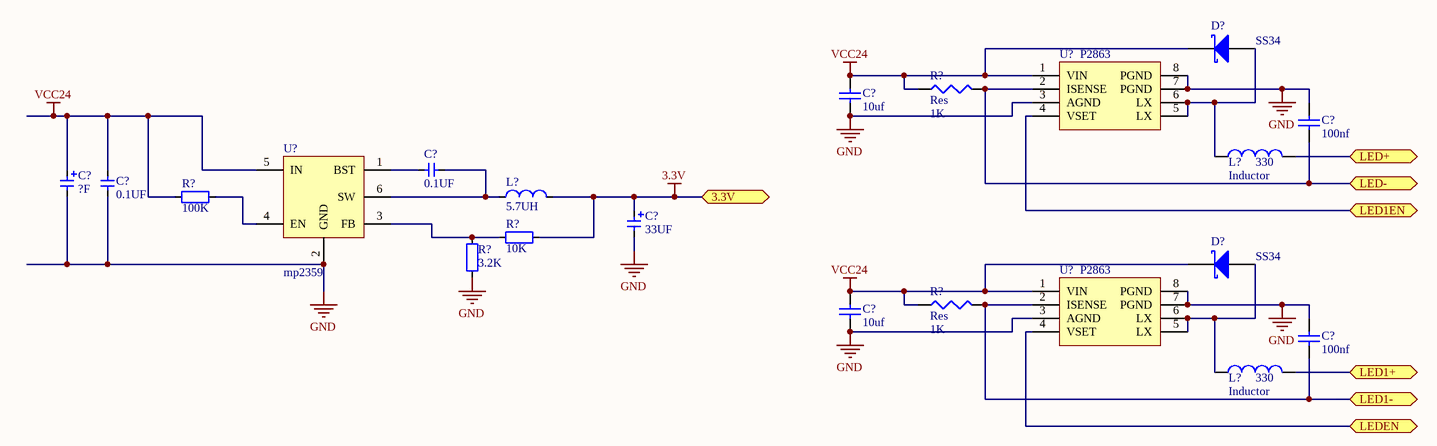
[diagram p4: power.SchDoc]

### Parts
(Parts that share a designator on the sheet are numbered #1, #2 ... from top to bottom, then left to right.)
C?#23  value 10uf  [1210]  (hidden comment: Cap)
C?#24  value 100nf  [C0805]  (hidden comment: Cap)
C?#25  value 0.1UF  [CAP_0603]  (hidden comment: Cap_0603)
C?#26  value ?F  [CAPAE6666X77M]  (hidden comment: Cap_63*77)
C?#27  value 0.1UF  [CAP_0603]  (hidden comment: Cap_0603)
C?#28  value 33UF  [CAP_TAN_A1206]  (hidden comment: Cap_Tan_1206)
C?#29  value 10uf  [1210]  (hidden comment: Cap)
C?#30  value 100nf  [C0805]  (hidden comment: Cap)
D?#1  SS34  [SMB]
D?#2  SS34  [SMB]
L?#1  Inductor  value 330  [ZIC-L10*10*4]
L?#2  value 5.7UH  [IND_CD32]  (hidden comment: Ind_CD32)
L?#3  Inductor  value 330  [ZIC-L10*10*4]
R?#8  Res  value 1K  [1206]
R?#9  value 100K  [RES_0603]  (hidden comment: Res_0603)
R?#10  value 10K  [RES_0603]  (hidden comment: Res_0603)
R?#11  value 3.2K  [RES_0603]  (hidden comment: Res_0603)
R?#12  Res  value 1K  [1206]
U?#11  P2863  [SOP-8]
U?#12  mp2359
U?#13  P2863  [SOP-8]

### Ports
3.3V, LED1+, LED1-, LED1EN, LED+, LED-, LEDEN

### Nets
3.3V: C?#28.1 L?#2.2 R?#10.2 ; port 3.3V  [project net 3.3]
GND: C?#23.1 C?#24.2 C?#26.2 C?#27.1 C?#28.2 C?#29.1 C?#30.2 R?#11.1 U?#11.3(AGND) U?#11.7(PGND) U?#11.8(PGND) U?#12.2(GND) U?#13.3(AGND) U?#13.7(PGND) U?#13.8(PGND)
VCC24: C?#23.2 C?#26.1 C?#27.2 C?#29.2 D?#1.2(K) D?#2.2(K) R?#8.1 R?#9.1 R?#12.1 U?#11.1(VIN) U?#12.5(IN) U?#13.1(VIN)
NetC?#24_1: C?#24.1 R?#8.2 U?#11.2(ISENSE) ; port LED-
NetC?#25_1: C?#25.1 U?#12.1(BST)
NetC?#25_2: C?#25.2 L?#2.1 U?#12.6(SW)
NetC?#30_1: C?#30.1 R?#12.2 U?#13.2(ISENSE) ; port LED1-
NetD?#1_1: D?#1.1(A) L?#1.1 U?#11.5(LX) U?#11.6(LX)
NetD?#2_1: D?#2.1(A) L?#3.1 U?#13.5(LX) U?#13.6(LX)
NetL?#1_2: L?#1.2 ; port LED+
NetL?#3_2: L?#3.2 ; port LED1+
NetR?#9_2: R?#9.2 U?#12.4(EN)
NetR?#10_1: R?#10.1 R?#11.2 U?#12.3(FB)
NetU?#11_4: U?#11.4(VSET) ; port LED1EN
NetU?#13_4: U?#13.4(VSET) ; port LEDEN

### Library data of the parts
C?#23 C?#29 = Cap: Capacitor; Published: 8-Jun-2000; LatestRevisionDate: 17-Jul-2002; LatestRevisionNote: Re-released for DXP Platform.; PackageReference: RAD-0.3; Publisher: Altium Limited; PackageDescription: Radial Cap, Thru-Hole; 2 Leads; 0.3 in Pin Spacing
C?#24 C?#30 = Cap0805: Capacitor (Semiconductor SIM Model); Published: 8-Jun-2000; LatestRevisionDate: 29-May-2009; LatestRevisionNote: IPC-7351 Footprint Added.; PackageReference: C1206; Publisher: Altium Limited; PackageDescription: Chip Capacitor
C?#25 C?#27 = Cap_0603: Capacitor
C?#26 = Cap_Tan_0805: Capacitor
C?#28 = Cap_Tan_1206: Capacitor
D?#1 D?#2 = D Schottky: Schottky Diode; Published: 8-Jun-2000; LatestRevisionDate: 17-Jul-2002; LatestRevisionNote: Re-released for DXP Platform.; PackageReference: SMB; Publisher: Altium Limited; PackageDescription: DO-214-AA/SMB; 2 C-Bend Leads; Body 5.3 x 3.6 mm, inc. leads (LxW); Code_JEDEC: DO-214-AA
L?#1 L?#3 = Inductor: Code_IEC: 1005; Published: 8-Jun-2000; LatestRevisionDate: 29-May-2009; LatestRevisionNote: IPC-7351 Footprint Added.; PackageReference: 0402-A; Publisher: Altium Limited; PackageDescription: Chip Inductor; Code_JEITA: 0402
L?#2 = Ind_CD32: Inductor
R?#8 R?#12 = Res1206: Resistor; Published: 8-Jun-2000; LatestRevisionDate: 29-May-2009; LatestRevisionNote: IPC-7351 Footprint Added.; PackageReference: J1-0603; Publisher: Altium Limited; PackageDescription: Chip Resistor
R?#9-R?#11 = Res_0603: Resistor
U?#11 U?#13 = P: LED Driver,SOP-8

## Sheet output.SchDoc
size A4
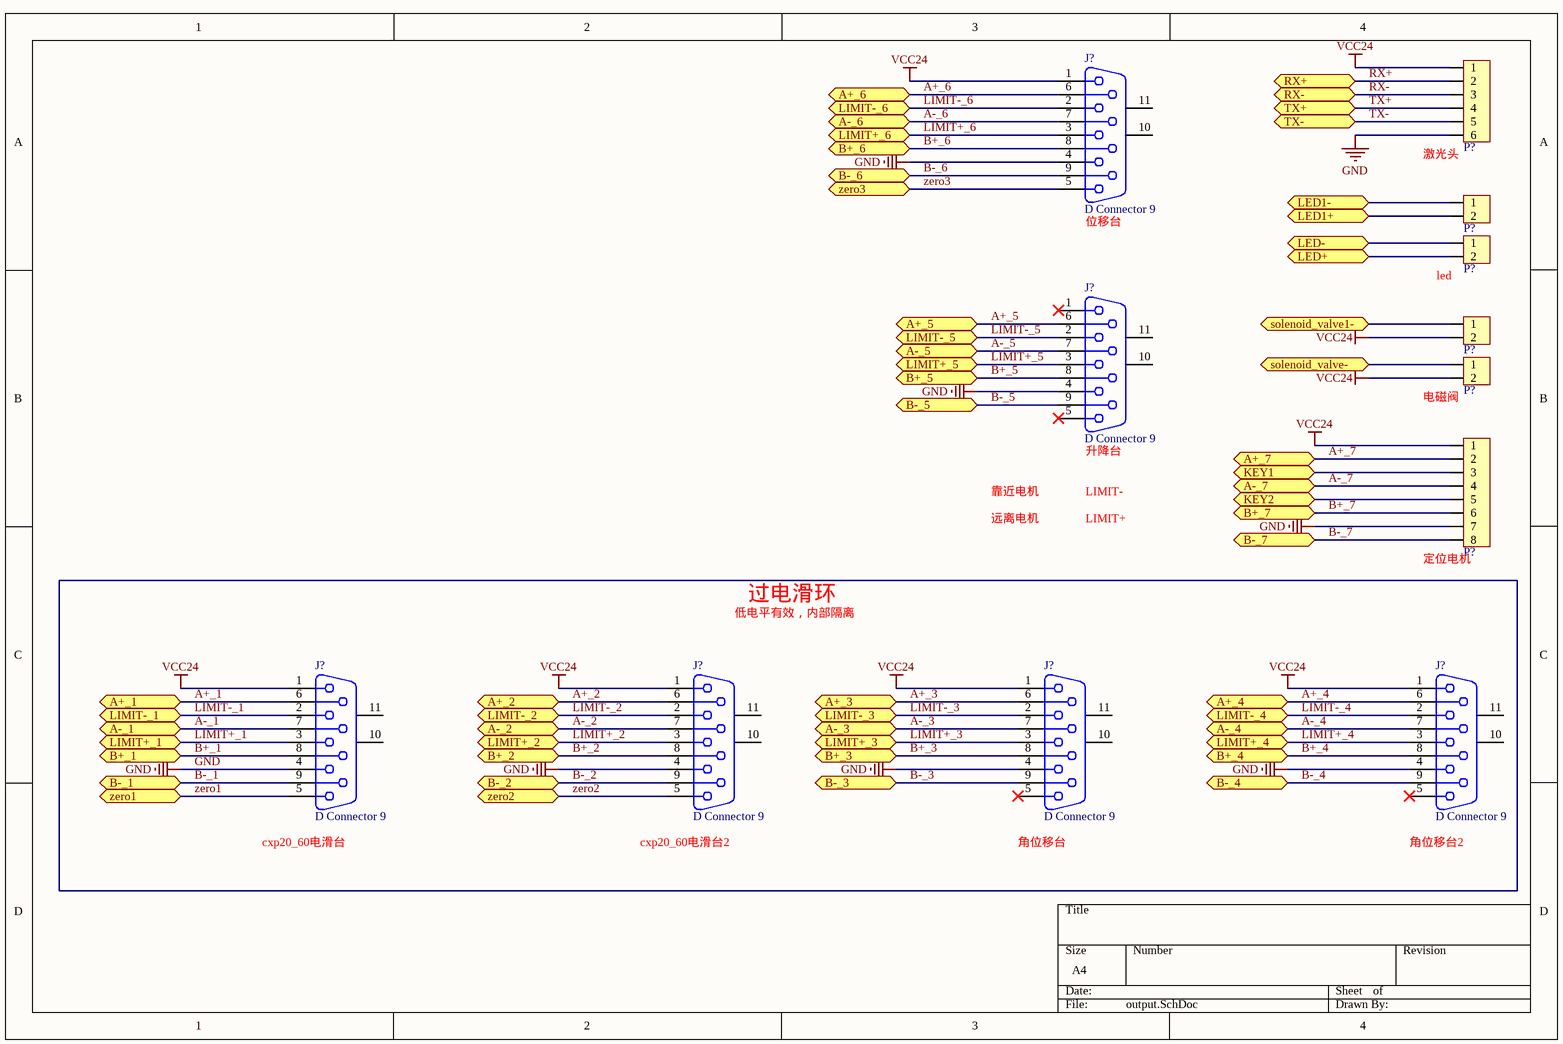
[diagram p5: output.SchDoc]

### Parts
(Parts that share a designator on the sheet are numbered #1, #2 ... from top to bottom, then left to right.)
J?#1  D Connector 9  [DSUB1.385-2H9]
J?#2  D Connector 9  [DSUB1.385-2H9]
J?#3  D Connector 9  [DSUB1.385-2H9]
J?#4  D Connector 9  [DSUB1.385-2H9]
J?#5  D Connector 9  [DSUB1.385-2H9]
J?#6  D Connector 9  [DSUB1.385-2H9]
P?#1  HDR1x6_2.54  [HDR1X6_2.54_180]  (value not drawn)
P?#2  HDR1x2_2.54  [HDR1X2_2.54_180]  (value not drawn)
P?#3  HDR1x2_2.54  [HDR1X2_2.54_180]  (value not drawn)
P?#4  HDR1x2_2.54  [HDR1X2_2.54_180]  (value not drawn)
P?#5  HDR1x2_2.54  [HDR1X2_2.54_180]  (value not drawn)
P?#6  HDR1x8_2.54  [HDR1X8_2.54_180]  (value not drawn)

### Ports
A+_1, A+_2, A+_3, A+_4, A+_5, A+_6, A+_7, A-_1, A-_2, A-_3, A-_4, A-_5, A-_6, A-_7, B+_1, B+_2, B+_3, B+_4, B+_5, B+_6, B+_7, B-_1, B-_2, B-_3, B-_4, B-_5, B-_6, B-_7, KEY1, KEY2, LED1+, LED1-, LED+, LED-, LIMIT+_1, LIMIT+_2, LIMIT+_3, LIMIT+_4, LIMIT+_5, LIMIT+_6, LIMIT-_1, LIMIT-_2, LIMIT-_3, LIMIT-_4, LIMIT-_5, LIMIT-_6, RX+, RX-, solenoid_valve1-, solenoid_valve-, TX+, TX-, zero1, zero2, zero3

### Nets
GND: J?#1.4 J?#2.4 J?#3.4 J?#4.4 J?#5.4 J?#6.4 P?#1.6 P?#6.7
VCC24: J?#1.1 J?#3.1 J?#4.1 J?#5.1 J?#6.1 P?#1.1 P?#4.2 P?#5.2 P?#6.1
A+_1: J?#3.6 ; port A+_1
A+_2: J?#4.6 ; port A+_2
A+_3: J?#5.6 ; port A+_3
A+_4: J?#6.6 ; port A+_4
A+_5: J?#2.6 ; port A+_5
A+_6: J?#1.6 ; port A+_6
A+_7: P?#6.2 ; port A+_7
A-_1: J?#3.7 ; port A-_1
A-_2: J?#4.7 ; port A-_2
A-_3: J?#5.7 ; port A-_3
A-_4: J?#6.7 ; port A-_4
A-_5: J?#2.7 ; port A-_5
A-_6: J?#1.7 ; port A-_6
A-_7: P?#6.4 ; port A-_7
B+_1: J?#3.8 ; port B+_1
B+_2: J?#4.8 ; port B+_2
B+_3: J?#5.8 ; port B+_3
B+_4: J?#6.8 ; port B+_4
B+_5: J?#2.8 ; port B+_5
B+_6: J?#1.8 ; port B+_6
B+_7: P?#6.6 ; port B+_7
B-_1: J?#3.9 ; port B-_1
B-_2: J?#4.9 ; port B-_2
B-_3: J?#5.9 ; port B-_3
B-_4: J?#6.9 ; port B-_4
B-_5: J?#2.9 ; port B-_5
B-_6: J?#1.9 ; port B-_6
B-_7: P?#6.8 ; port B-_7
LIMIT+7: P?#6.5 ; port KEY2
LIMIT+_1: J?#3.3 ; port LIMIT+_1  [project net LIMIT+1]
LIMIT+_2: J?#4.3 ; port LIMIT+_2  [project net LIMIT+2]
LIMIT+_3: J?#5.3 ; port LIMIT+_3  [project net LIMIT+3]
LIMIT+_4: J?#6.3 ; port LIMIT+_4  [project net LIMIT+4]
LIMIT+_5: J?#2.3 ; port LIMIT+_5  [project net LIMIT+5]
LIMIT+_6: J?#1.3 ; port LIMIT+_6  [project net LIMIT+6]
LIMIT-7: P?#6.3 ; port KEY1
LIMIT-_1: J?#3.2 ; port LIMIT-_1  [project net LIMIT-1]
LIMIT-_2: J?#4.2 ; port LIMIT-_2  [project net LIMIT-2]
LIMIT-_3: J?#5.2 ; port LIMIT-_3  [project net LIMIT-3]
LIMIT-_4: J?#6.2 ; port LIMIT-_4  [project net LIMIT-4]
LIMIT-_5: J?#2.2 ; port LIMIT-_5  [project net LIMIT-5]
LIMIT-_6: J?#1.2 ; port LIMIT-_6  [project net LIMIT-6]
RX+: P?#1.2 ; port RX+  [project net R+]
RX-: P?#1.3 ; port RX-  [project net R-]
TX+: P?#1.4 ; port TX+  [project net T+]
TX-: P?#1.5 ; port TX-  [project net T-]
zero1: J?#3.5 ; port zero1
zero2: J?#4.5 ; port zero2
zero3: J?#1.5 ; port zero3
NetP?#2_1: P?#2.1 ; port LED1-
NetP?#2_2: P?#2.2 ; port LED1+
NetP?#3_1: P?#3.1 ; port LED-
NetP?#3_2: P?#3.2 ; port LED+
NetP?#4_1: P?#4.1 ; port solenoid_valve1-
NetP?#5_1: P?#5.1 ; port solenoid_valve-

Not connected (* = marked no-connect by the designer): J?#1 10(MH1) 11(MH2); J?#2 1* 5* 10(MH1) 11(MH2); J?#3 10(MH1) 11(MH2); J?#4 10(MH1) 11(MH2); J?#5 5* 10(MH1) 11(MH2); J?#6 5* 10(MH1) 11(MH2)

### Notes on the sheet
- (near P?#1) 激光头
- (near J?#1) 位移台
- (near P?#3) led
- (near J?#2) 升降台
- (near P?#5) 电磁阀
- 靠近电机
- 远离电机
- LIMIT-
- LIMIT+
- (near P?#6) 定位电机
- 低电平有效，内部隔离
- 过电滑环
- (near J?#3) cxp20_60电滑台
- (near J?#4) cxp20_60电滑台2
- (near J?#5) 角位移台
- (near J?#6) 角位移台2

### Library data of the parts
J?#1-J?#6 = D Connector 9: Receptacle Assembly, 9 Position, Right Angle; PackageDocument: O; Positions: 9; Published: 15-Jun-2001; LatestRevisionDate: 17-Jul-2002; LatestRevisionNote: Re-released for DXP Platform.; DatasheetDocument: 1-Sep-1999; PackageReference: 788750; Publisher: Altium Limited; Orientation: Right Angle; Gender: Receptacle
P?#1 = HDR1x6_2.54: Header
P?#2-P?#5 = HDR1x2_2.54: Header
P?#6 = HDR1x8_2.54: Header

## Nets that join several sheets
3.3: drv8825 (SW?.1ON SW?.2ON SW?.3ON), U_DRV8825_MODE1 (5 pins), stm32f1 (14 pins), power (C?#28.1 L?#2.2 R?#10.2), U_DRV8825_MODE2 (5 pins), U_DRV8825_MODE3 (5 pins), U_DRV8825_MODE4 (5 pins), U_DRV8825_MODE5 (5 pins), U_DRV8825_MODE6 (5 pins), U_DRV8825_MODE7 (5 pins)
GND: drv8825 (8 pins), U_DRV8825_MODE1 (C?_U_DRV8825_MODE1.2 U?_U_DRV8825_MODE1.9 U?_U_DRV8825_MODE1.14), stm32f1 (25 pins), power (15 pins), output (8 pins), U_DRV8825_MODE2 (C?_U_DRV8825_MODE2.2 U?_U_DRV8825_MODE2.9 U?_U_DRV8825_MODE2.14), U_DRV8825_MODE3 (C?_U_DRV8825_MODE3.2 U?_U_DRV8825_MODE3.9 U?_U_DRV8825_MODE3.14), U_DRV8825_MODE4 (C?_U_DRV8825_MODE4.2 U?_U_DRV8825_MODE4.9 U?_U_DRV8825_MODE4.14), U_DRV8825_MODE5 (C?_U_DRV8825_MODE5.2 U?_U_DRV8825_MODE5.9 U?_U_DRV8825_MODE5.14), U_DRV8825_MODE6 (C?_U_DRV8825_MODE6.2 U?_U_DRV8825_MODE6.9 U?_U_DRV8825_MODE6.14), U_DRV8825_MODE7 (C?_U_DRV8825_MODE7.2 U?_U_DRV8825_MODE7.9 U?_U_DRV8825_MODE7.14)
VCC24: drv8825 (6 pins), U_DRV8825_MODE1 (C?_U_DRV8825_MODE1.1 U?_U_DRV8825_MODE1.15), power (12 pins), output (9 pins), U_DRV8825_MODE2 (C?_U_DRV8825_MODE2.1 U?_U_DRV8825_MODE2.15), U_DRV8825_MODE3 (C?_U_DRV8825_MODE3.1 U?_U_DRV8825_MODE3.15), U_DRV8825_MODE4 (C?_U_DRV8825_MODE4.1 U?_U_DRV8825_MODE4.15), U_DRV8825_MODE5 (C?_U_DRV8825_MODE5.1 U?_U_DRV8825_MODE5.15), U_DRV8825_MODE6 (C?_U_DRV8825_MODE6.1 U?_U_DRV8825_MODE6.15), U_DRV8825_MODE7 (C?_U_DRV8825_MODE7.1 U?_U_DRV8825_MODE7.15)
A+_1: U_DRV8825_MODE1 (U?_U_DRV8825_MODE1.11), output (J?#3.6)
A+_2: output (J?#4.6), U_DRV8825_MODE2 (U?_U_DRV8825_MODE2.11)
A+_3: output (J?#5.6), U_DRV8825_MODE3 (U?_U_DRV8825_MODE3.11)
A+_4: output (J?#6.6), U_DRV8825_MODE4 (U?_U_DRV8825_MODE4.11)
A+_5: output (J?#2.6), U_DRV8825_MODE5 (U?_U_DRV8825_MODE5.11)
A+_6: output (J?#1.6), U_DRV8825_MODE6 (U?_U_DRV8825_MODE6.11)
A+_7: output (P?#6.2), U_DRV8825_MODE7 (U?_U_DRV8825_MODE7.11)
A-_1: U_DRV8825_MODE1 (U?_U_DRV8825_MODE1.12), output (J?#3.7)
A-_2: output (J?#4.7), U_DRV8825_MODE2 (U?_U_DRV8825_MODE2.12)
A-_3: output (J?#5.7), U_DRV8825_MODE3 (U?_U_DRV8825_MODE3.12)
A-_4: output (J?#6.7), U_DRV8825_MODE4 (U?_U_DRV8825_MODE4.12)
A-_5: output (J?#2.7), U_DRV8825_MODE5 (U?_U_DRV8825_MODE5.12)
A-_6: output (J?#1.7), U_DRV8825_MODE6 (U?_U_DRV8825_MODE6.12)
A-_7: output (P?#6.4), U_DRV8825_MODE7 (U?_U_DRV8825_MODE7.12)
B+_1: U_DRV8825_MODE1 (U?_U_DRV8825_MODE1.13), output (J?#3.8)
B+_2: output (J?#4.8), U_DRV8825_MODE2 (U?_U_DRV8825_MODE2.13)
B+_3: output (J?#5.8), U_DRV8825_MODE3 (U?_U_DRV8825_MODE3.13)
B+_4: output (J?#6.8), U_DRV8825_MODE4 (U?_U_DRV8825_MODE4.13)
B+_5: output (J?#2.8), U_DRV8825_MODE5 (U?_U_DRV8825_MODE5.13)
B+_6: output (J?#1.8), U_DRV8825_MODE6 (U?_U_DRV8825_MODE6.13)
B+_7: output (P?#6.6), U_DRV8825_MODE7 (U?_U_DRV8825_MODE7.13)
B-_1: U_DRV8825_MODE1 (U?_U_DRV8825_MODE1.12), output (J?#3.9)
B-_2: output (J?#4.9), U_DRV8825_MODE2 (U?_U_DRV8825_MODE2.12)
B-_3: output (J?#5.9), U_DRV8825_MODE3 (U?_U_DRV8825_MODE3.12)
B-_4: output (J?#6.9), U_DRV8825_MODE4 (U?_U_DRV8825_MODE4.12)
B-_5: output (J?#2.9), U_DRV8825_MODE5 (U?_U_DRV8825_MODE5.12)
B-_6: output (J?#1.9), U_DRV8825_MODE6 (U?_U_DRV8825_MODE6.12)
B-_7: output (P?#6.8), U_DRV8825_MODE7 (U?_U_DRV8825_MODE7.12)
dir_motor1: U_DRV8825_MODE1 (U?_U_DRV8825_MODE1.8), stm32f1 (U?#5.12)
dir_motor2: stm32f1 (U?#5.13), U_DRV8825_MODE2 (U?_U_DRV8825_MODE2.8)
dir_motor3: stm32f1 (U?#5.14), U_DRV8825_MODE3 (U?_U_DRV8825_MODE3.8)
dir_motor4: stm32f1 (U?#5.15), U_DRV8825_MODE4 (U?_U_DRV8825_MODE4.8)
dir_motor5: stm32f1 (U?#5.16), U_DRV8825_MODE5 (U?_U_DRV8825_MODE5.8)
dir_motor6: stm32f1 (U?#5.17), U_DRV8825_MODE6 (U?_U_DRV8825_MODE6.8)
dir_motor7: stm32f1 (U?#5.18), U_DRV8825_MODE7 (U?_U_DRV8825_MODE7.8)
en_motor1: U_DRV8825_MODE1 (U?_U_DRV8825_MODE1.1), stm32f1 (U?#9.12)
en_motor2: stm32f1 (U?#9.13), U_DRV8825_MODE2 (U?_U_DRV8825_MODE2.1)
en_motor3: stm32f1 (U?#9.14), U_DRV8825_MODE3 (U?_U_DRV8825_MODE3.1)
en_motor4: stm32f1 (U?#9.15), U_DRV8825_MODE4 (U?_U_DRV8825_MODE4.1)
en_motor5: stm32f1 (U?#9.16), U_DRV8825_MODE5 (U?_U_DRV8825_MODE5.1)
en_motor6: stm32f1 (U?#9.17), U_DRV8825_MODE6 (U?_U_DRV8825_MODE6.1)
en_motor7: stm32f1 (U?#9.18), U_DRV8825_MODE7 (U?_U_DRV8825_MODE7.1)
LIMIT+1: stm32f1 (U?#6.13), output (J?#3.3)
LIMIT+2: stm32f1 (U?#6.15), output (J?#4.3)
LIMIT+3: stm32f1 (U?#6.17), output (J?#5.3)
LIMIT+4: stm32f1 (U?#6.20), output (J?#6.3)
LIMIT+5: stm32f1 (U?#8.13), output (J?#2.3)
LIMIT+6: stm32f1 (U?#8.15), output (J?#1.3)
LIMIT+7: stm32f1 (U?#8.17), output (P?#6.5)
LIMIT-1: stm32f1 (U?#6.12), output (J?#3.2)
LIMIT-2: stm32f1 (U?#6.14), output (J?#4.2)
LIMIT-3: stm32f1 (U?#6.16), output (J?#5.2)
LIMIT-4: stm32f1 (U?#6.18), output (J?#6.2)
LIMIT-5: stm32f1 (U?#8.12), output (J?#2.2)
LIMIT-6: stm32f1 (U?#8.14), output (J?#1.2)
LIMIT-7: stm32f1 (U?#8.16), output (P?#6.3)
R+: stm32f1 (U?#3.8), output (P?#1.2)
R-: stm32f1 (U?#3.7), output (P?#1.3)
step_motor1: U_DRV8825_MODE1 (U?_U_DRV8825_MODE1.7), stm32f1 (U?#7.12)
step_motor2: stm32f1 (U?#7.13), U_DRV8825_MODE2 (U?_U_DRV8825_MODE2.7)
step_motor3: stm32f1 (U?#7.14), U_DRV8825_MODE3 (U?_U_DRV8825_MODE3.7)
step_motor4: stm32f1 (U?#7.15), U_DRV8825_MODE4 (U?_U_DRV8825_MODE4.7)
step_motor5: stm32f1 (U?#7.16), U_DRV8825_MODE5 (U?_U_DRV8825_MODE5.7)
step_motor6: stm32f1 (U?#7.17), U_DRV8825_MODE6 (U?_U_DRV8825_MODE6.7)
step_motor7: stm32f1 (U?#7.18), U_DRV8825_MODE7 (U?_U_DRV8825_MODE7.7)
T+: stm32f1 (U?#3.5), output (P?#1.4)
T-: stm32f1 (U?#3.6), output (P?#1.5)
zero1: stm32f1 (U?#4.46 U?#8.1 U?#8.18), output (J?#3.5)
zero2: stm32f1 (U?#4.9 U?#8.20 U?#10.9), output (J?#4.5)
zero3: stm32f1 (U?#10.12), output (J?#1.5)